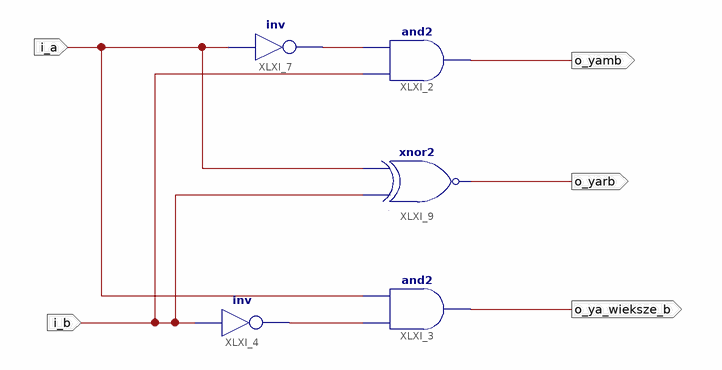
[diagram p0: schematic sheet 1]
// Xilinx ISE schematic Laby5.sch (spartan3e) as structural Verilog: 5 symbols, 5 ports
module Laby5 (
  input  i_b,
  input  i_a,
  output o_yamb,
  output o_yarb,
  output o_ya_wieksze_b
);

  wire XLXN_1, XLXN_11;

  and XLXI_2 (o_yamb, i_b, XLXN_11);
  and XLXI_3 (o_ya_wieksze_b, XLXN_1, i_a);
  not XLXI_4 (XLXN_1, i_b);
  not XLXI_7 (XLXN_11, i_a);
  xnor XLXI_9 (o_yarb, i_b, i_a);
endmodule
